# Altium schematic sheet ExternalRAM.SchDoc
size A4; Organization: Altium Limited; Address1: L3, 12a Rodborough Rd; Address2: Frenchs Forest; Address3: NSW; Address4: Australia 2086
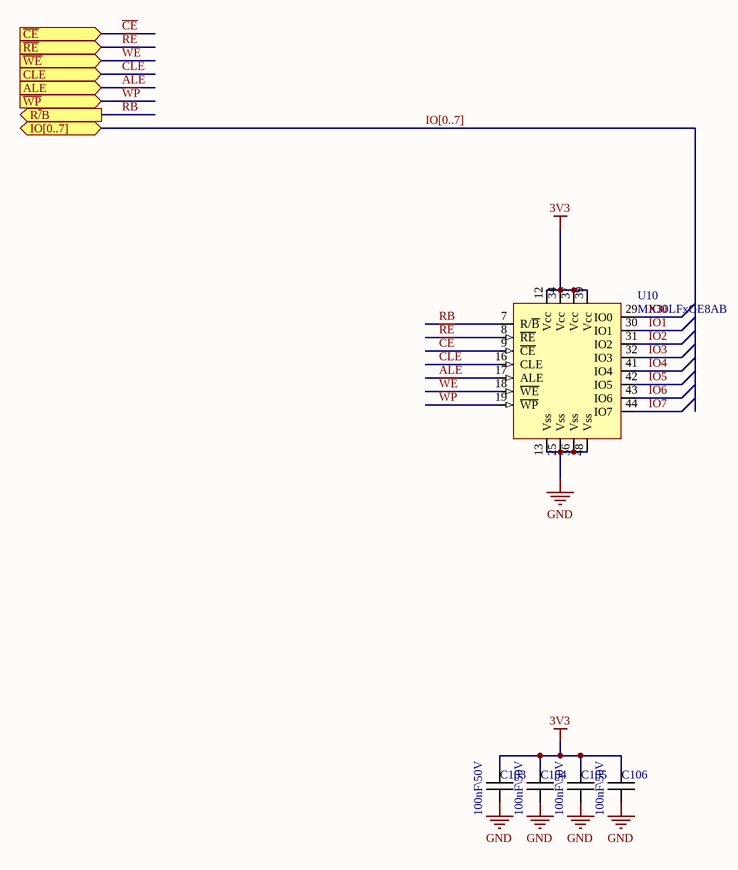
[diagram p0: ExternalRAM.SchDoc]

## Parts
C103  100nF\50V  [SMD 0603]
C104  100nF\50V  [SMD 0603]
C105  100nF\50V  [SMD 0603]
C106  100nF\50V  [SMD 0603]
U10  MX30LFxGE8AB  [TSSOP50P2000X120-48N]

## Ports
ALE (in), CLE (in), IO[0..7] (bidir), R~{/}B (out), ~{CE} (in), ~{RE} (in), ~{WE} (in), ~{WP} (in)

## Nets
3V3: C103.2 C104.2 C105.2 C106.2 U10.12(Vcc) U10.34(Vcc) U10.37(Vcc) U10.39(Vcc)
GND: C103.1 C104.1 C105.1 C106.1 U10.13(Vss) U10.25(Vss) U10.36(Vss) U10.48(Vss)
~{CE}: U10.9(~{CE}) ; port ~{CE}
~{RE}: U10.8(~{RE}) ; port ~{RE}
~{WE}: U10.18(~{WE}) ; port ~{WE}
~{WP}: U10.19(~{WP}) ; port ~{WP}
ALE: U10.17(ALE) ; port ALE
CLE: U10.16(CLE) ; port CLE
IO0: U10.29(IO0)
IO1: U10.30(IO1)
IO2: U10.31(IO2)
IO3: U10.32(IO3)
IO4: U10.41(IO4)
IO5: U10.42(IO5)
IO6: U10.43(IO6)
IO7: U10.44(IO7)
RB: U10.7(R/~{B}) ; port R~{/}B

## Buses and harness runs
bus IO[0..7] = port IO[0..7]

## Notes on the sheet
- Title
- Size:
- Date:
- A4
- Number:
- Time:
- Revision:
- Sheet
- of
- File:

## Library data of the parts
C103-C106 = Capasitor: CC0603KRX7R9BB104; Value: 100nF\50V
U10 = MX30LFxGE8AB: 1G/2G/4G-bit NAND Flash Memory  (ECC-Free); ComponentLink1Description: Datasheet; ComponentLink1URL: https://www.mxic.com.tw/Lists/Datasheet/Attachments/6854/MX30LF4GE8AB,%203V,%204Gb,%20v1.3.pdf